# Altium schematic sheet SCH_FT232H.SchDoc
size B
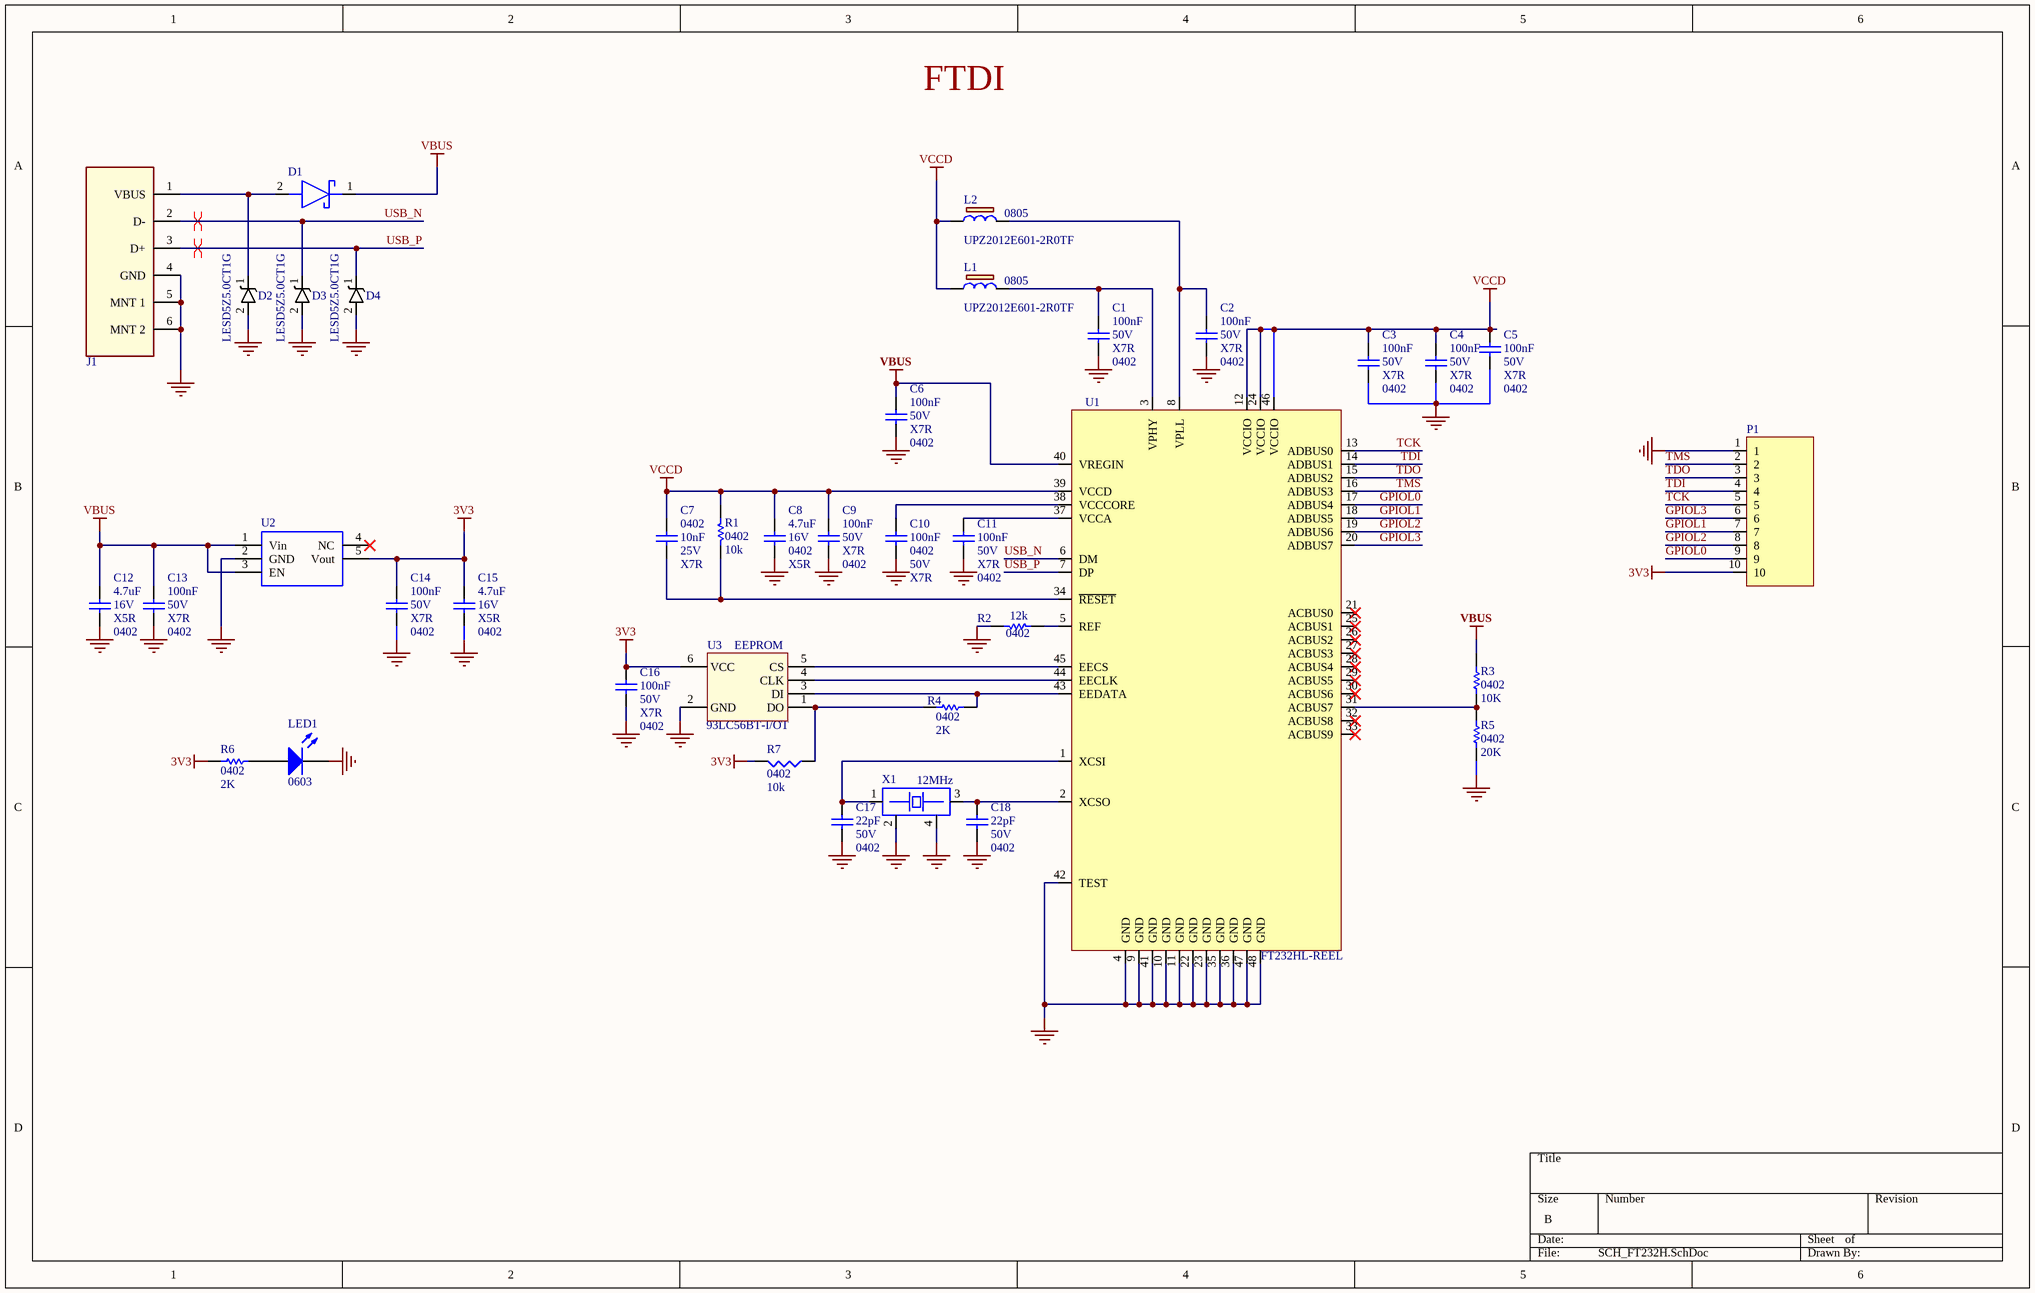
[diagram p0: SCH_FT232H.SchDoc]

## Parts
C1  value 100nF  Case/Package: 0402  Voltage: 50V  Dielectric: X7R  [CAPC0402]
C2  value 100nF  Case/Package: 0402  Voltage: 50V  Dielectric: X7R  [CAPC0402]
C3  value 100nF  Case/Package: 0402  Voltage: 50V  Dielectric: X7R  [CAPC0402]
C4  value 100nF  Case/Package: 0402  Voltage: 50V  Dielectric: X7R  [CAPC0402]
C5  value 100nF  Case/Package: 0402  Voltage: 50V  Dielectric: X7R  [CAPC0402]
C6  value 100nF  Case/Package: 0402  Voltage: 50V  Dielectric: X7R  [CAPC0402]
C7  value 10nF  Case/Package: 0402  Voltage: 25V  Dielectric: X7R  [CAPC0402]
C8  value 4.7uF  Case/Package: 0402  Voltage: 16V  Dielectric: X5R  [CAPC0402]
C9  value 100nF  Case/Package: 0402  Voltage: 50V  Dielectric: X7R  [CAPC0402]
C10  value 100nF  Case/Package: 0402  Voltage: 50V  Dielectric: X7R  [CAPC0402]
C11  value 100nF  Case/Package: 0402  Voltage: 50V  Dielectric: X7R  [CAPC0402]
C12  value 4.7uF  Case/Package: 0402  Voltage: 16V  Dielectric: X5R  [CAPC0402]
C13  value 100nF  Case/Package: 0402  Voltage: 50V  Dielectric: X7R  [CAPC0402]
C14  value 100nF  Case/Package: 0402  Voltage: 50V  Dielectric: X7R  [CAPC0402]
C15  value 4.7uF  Case/Package: 0402  Voltage: 16V  Dielectric: X5R  [CAPC0402]
C16  value 100nF  Case/Package: 0402  Voltage: 50V  Dielectric: X7R  [CAPC0402]
C17  value 22pF  Case/Package: 0402  Voltage: 50V  [CAPC0402]
C18  value 22pF  Case/Package: 0402  Voltage: 50V  [CAPC0402]
D1  (no value)  [BAT760-7]
D2  Manufacturer Part Number: LESD5Z5.0CT1G  [SOD523]
D3  Manufacturer Part Number: LESD5Z5.0CT1G  [SOD523]
D4  Manufacturer Part Number: LESD5Z5.0CT1G  [SOD523]
J1  (no value)  [Molex_48037-0001_0]
L1  Manufacturer Part Number: UPZ2012E601-2R0TF  Case/Package: 0805  [ferrite bead 600R 0.5A]
L2  Manufacturer Part Number: UPZ2012E601-2R0TF  Case/Package: 0805  [ferrite bead 600R 0.5A]
LED1  Case/Package: 0603  [led_0603]
P1  (no value)  [10 pin smd]  (no BOM)
R1  value 10k  Case/Package: 0402  [RESC0402]
R2  value 12k  Case/Package: 0402  [RESC0402]
R3  value 10K  Case/Package: 0402  [RESC0402]
R4  value 2K  Case/Package: 0402  [RESC0402]
R5  value 20K  Case/Package: 0402  [RESC0402]
R6  value 2K  Case/Package: 0402  [RESC0402]
R7  value 10k  Case/Package: 0402  [RESC0402]
U1  Manufacturer Part Number: FT232HL-REEL  [LQFP-48_7x7x05P__  FT232HL-REEL]
U2  (no value)  [SOT25]
U3  Memory Type: EEPROM  [SOT-23-6]
X1  Frequency: 12MHz  [Crystal_3225]

## Nets
3V3: C14.2 C15.2 C16.2 P1.10 R6.1 R7.2 U2.5(Vout) U3.6(VCC)
GND: C1.1 C2.1 C3.2 C4.2 C5.2 C6.1 C8.1 C9.1 C10.1 C11.1 C12.1 C13.1 C14.1 C15.1 C16.1 C17.1 C18.1 D2.2(A) D3.2(A) D4.2(A) J1.4(GND) J1.5(MNT_1) J1.6(MNT_2) LED1.K P1.1 R2.1 R5.2 U1.4(GND) U1.9(GND) U1.10(GND) U1.11(GND) U1.22(GND) U1.23(GND) U1.35(GND) U1.36(GND) U1.41(GND) U1.42(TEST) U1.47(GND) U1.48(GND) U2.2(GND) U3.2(GND) X1.2 X1.4
VBUS: C6.2 C12.2 C13.2 D1.1(K) R3.1 U1.40(VREGIN) U2.1(Vin) U2.3(EN)
VCCD: C3.1 C4.1 C5.1 C7.2 C8.2 C9.2 L1.1 L2.1 R1.2 U1.12(VCCIO) U1.24(VCCIO) U1.39(VCCD) U1.46(VCCIO)
GPIOL0: P1.9 U1.17(ADBUS4)
GPIOL1: P1.7 U1.18(ADBUS5)
GPIOL2: P1.8 U1.19(ADBUS6)
GPIOL3: P1.6 U1.20(ADBUS7)
TCK: P1.5 U1.13(ADBUS0)
TDI: P1.4 U1.14(ADBUS1)
TDO: P1.3 U1.15(ADBUS2)
TMS: P1.2 U1.16(ADBUS3)
USB_N: D3.1(K) J1.2(D-) U1.6(DM)
USB_P: D4.1(K) J1.3(D+) U1.7(DP)
NetC1_2: C1.2 L1.2 U1.3(VPHY)
NetC2_2: C2.2 L2.2 U1.8(VPLL)
NetC7_1: C7.1 R1.1 U1.34(~{RESET})
NetC10_2: C10.2 U1.38(VCCCORE)
NetC11_2: C11.2 U1.37(VCCA)
NetC17_2: C17.2 U1.1(XCSI) X1.1
NetC18_2: C18.2 U1.2(XCSO) X1.3
NetD1_2: D1.2(A) D2.1(K) J1.1(VBUS)
NetLED1_A: LED1.A R6.2
NetR2_2: R2.2 U1.5(REF)
NetR3_2: R3.2 R5.1 U1.31(ACBUS7)
NetR4_1: R4.1 R7.1 U3.1(DO)
NetR4_2: R4.2 U1.43(EEDATA) U3.3(DI)
NetU1_44: U1.44(EECLK) U3.4(CLK)
NetU1_45: U1.45(EECS) U3.5(CS)

Not connected (* = marked no-connect by the designer): U1 21(ACBUS0)* 25(ACBUS1)* 26(ACBUS2)* 27(ACBUS3)* 28(ACBUS4)* 29(ACBUS5)* 30(ACBUS6)* 32(ACBUS8)* 33(ACBUS9)*; U2 4(NC)*

## Layout directives
differential pair; net class DIFF90: USB_N, USB_P

## Notes on the sheet
- FTDI

## Library data of the parts
C1-C6 C9-C11 C13 C14 C16 = Capacitor: CAP CER 100nF 50V X7R 0402; Manufacturer Part Number: *
C7 = Capacitor: CAP CER 10nF 25V X7R 0402; Manufacturer Part Number: *
C8 C12 C15 = Capacitor: CAP CER 4.7uF 16V X5R 0402; Manufacturer Part Number: *
C17 C18 = Capacitor: CAP CER 22pF 50V 0402; Manufacturer Part Number: *
D1 = B5819WS: DIODE SCHOTTKY 40V 1A SOD323; Manufacturer Part Number: B5819WS; Case/Package: SOD-323
D2-D4 = ESD9X5.0ST5G: 12.3V Clamp 8.7A (8/20µs) Ipp Tvs Diode Surface Mount SOD-523; Case/Package: SOD-523; ComponentLink1URL: https://datasheet.ciiva.com/30478/0900766b812769b5-30478676.pdf?src-supplier=RSComponents; ComponentLink1Description: https://datasheet.ciiva.com/30478/0900766b812769b5-30478676.pdf?src-supplier=RSComponents; ComponentLink2URL: https://datasheet.ciiva.com/25958/esd9x3-3st5g-d-25958458.pdf?src-supplier=Avnet+Europe; ComponentLink2Description: https://datasheet.ciiva.com/25958/esd9x3-3st5g-d-25958458.pdf?src-supplier=Avnet+Europe; ComponentLink3URL: https://datasheet.ciiva.com/1219/1748783-1219324.pdf?src-supplier=Newark; ComponentLink3Description: https://datasheet.ciiva.com/1219/1748783-1219324.pdf?src-supplier=Newark; ComponentLink4URL: https://datasheet.ciiva.com/3304/esd9x3-3st5g-d-3304012.pdf?src-supplier=Avnet; ComponentLink4Description: https://datasheet.ciiva.com/3304/esd9x3-3st5g-d-3304012.pdf?src-supplier=Avnet; ComponentLink5URL: https://datasheet.ciiva.com/339/esd9x3-3st5g-d-339709.pdf?src-supplier=Digi-Key; ComponentLink5Description: https://datasheet.ciiva.com/339/esd9x3-3st5g-d-339709.pdf?src-supplier=Digi-Key; ComponentLink6URL: https://datasheet.ciiva.com/16215/esd9x3-3st5g-d-16215149.pdf?src-supplier=Future+Electronics; ComponentLink6Description: https://datasheet.ciiva.com/16215/esd9x3-3st5g-d-16215149.pdf?src-supplier=Future+Electronics; ComponentLink7URL: https://datasheet.ciiva.com/339/esd9x3-3st5g-d-339710.pdf?src-supplier=Digi-Key; ComponentLink7Description: https://datasheet.ciiva.com/339/esd9x3-3st5g-d-339710.pdf?src-supplier=Digi-Key; ComponentLink8URL: https://datasheet.ciiva.com/339/esd9x3-3st5g-d-339711.pdf?src-supplier=Digi-Key; ComponentLink8Description: https://datasheet.ciiva.com/339/esd9x3-3st5g-d-339711.pdf?src-supplier=Digi-Key
J1 = USB MALE: USB A-type Plug Male PCB R/A; Manufacturer Part Number: USB Type A male; Case/Package: TH
L1 L2 = Ferrite Bead: Ferrite Beads 600 OHM 25% 2A
LED1 = LED: RED LED 0603; Manufacturer Part Number: *; Value: *
P1 = Header 10: Header, 10-Pin; Manufacturer Part Number: 17-Jul-2002; Case/Package: Re-released for DXP Platform.
R1 R3 = Res1: Thick Film Resistor -  10Kohm, 1%, 0402
  R3: Manufacturer Part Number: *
R2 = Res1: Thick Film Resistor -  12Kohm, 1%, 0402; ComponentLink1URL: http://uk.rs-online.com/webdocs/0d98/0900766b80d98824.pdf?src-supplier=RSComponents; ComponentLink1Description: http://uk.rs-online.com/webdocs/0d98/0900766b80d98824.pdf?src-supplier=RSComponents; ComponentLink2URL: http://www.vishay.com/docs/20035/dcrcwe3.pdf?src-supplier=Digi-Key; ComponentLink2Description: http://www.vishay.com/docs/20035/dcrcwe3.pdf?src-supplier=Digi-Key; ComponentLink3URL: http://www.farnell.com/datasheets/2045673.pdf?src-supplier=Element14; ComponentLink3Description: http://www.farnell.com/datasheets/2045673.pdf?src-supplier=Element14; ComponentLink4URL: http://www.vishay.com/docs/20035/dcrcwe3.pdf?src-supplier=Avnet; ComponentLink4Description: http://www.vishay.com/docs/20035/dcrcwe3.pdf?src-supplier=Avnet; ComponentLink5URL: https://www.distrelec.biz/Web/Downloads/a_/en/flD-CRCW-e3_data_en.pdf?mime=application%2Fpdf&src-supplier=Distrelec; ComponentLink5Description: https://www.distrelec.biz/Web/Downloads/a_/en/flD-CRCW-e3_data_en.pdf?mime=application%2Fpdf&src-supplier=Distrelec; ComponentLink6URL: http://www.vishay.com/docs/20035/dcrcwe3.pdf?src-supplier=Mouser; ComponentLink6Description: http://www.vishay.com/docs/20035/dcrcwe3.pdf?src-supplier=Mouser; ComponentLink7URL: http://www.farnell.com/datasheets/2111203.pdf?src-supplier=Element14; ComponentLink7Description: http://www.farnell.com/datasheets/2111203.pdf?src-supplier=Element14; ComponentLink8URL: http://www.vishay.com/docs/20035/dcrcwe3.pdf?src-supplier=Future+Electronics; ComponentLink8Description: http://www.vishay.com/docs/20035/dcrcwe3.pdf?src-supplier=Future+Electronics; ComponentLink9URL: https://www.te.com/commerce/DocumentDelivery/DDEController?Action=srchrtrv&amp;DocNm=1773204-3&amp;DocType=DS&amp;DocLang=English&src-supplier=Digi-Key; ComponentLink9Description: https://www.te.com/commerce/DocumentDelivery/DDEController?Action=srchrtrv&amp;DocNm=1773204-3&amp;DocType=DS&amp;DocLang=English&src-supplier=Digi-Key; ComponentLink10URL: https://4donline.ihs.com/images/VipMasterIC/IC/TYEL/TYEL-S-A0004929575/TYEL-S-A0004929575-1.pdf?hkey=52A5661711E402568146F3353EA87419&src-supplier=Farnell; ComponentLink10Description: https://4donline.ihs.com/images/VipMasterIC/IC/TYEL/TYEL-S-A0004929575/TYEL-S-A0004929575-1.pdf?hkey=52A5661711E402568146F3353EA87419&src-supplier=Farnell; ComponentLink11URL: https://4donline.ihs.com/images/VipMasterIC/IC/TYEL/TYEL-S-A0004929575/TYEL-S-A0004929575-1.pdf?hkey=52A5661711E402568146F3353EA87419&src-supplier=Newark; ComponentLink11Description: https://4donline.ihs.com/images/VipMasterIC/IC/TYEL/TYEL-S-A0004929575/TYEL-S-A0004929575-1.pdf?hkey=52A5661711E402568146F3353EA87419&src-supplier=Newark
R4 R6 = Res1: Thick Film Resistor -  2Kohm, 1%, 0402
  R6: Manufacturer Part Number: *
R5 = Res1: Thick Film Resistor -  20Kohm, 1%, 0402; Manufacturer Part Number: *
R7 = Res: Thick Film Resistor -  10Kohm, 1%, 0402
U1 = FT232HL: USB Interface IC USB HS to UART/FIFO SPI/JTAG/I2C LQFP-48; Case/Package: LQFP-48_7x7x05P
U2 = LDO_5V_3V: LDO Voltage Regulators 600mA CMOS LDO 50mA 3.3V 250mV; Manufacturer Part Number: AP2112K-3.3TRG1; Case/Package: SOT25; ComponentLink1URL: http://www.diodes.com/datasheets/AP2112.pdf?src-supplier=Avnet; ComponentLink1Description: http://www.diodes.com/datasheets/AP2112.pdf?src-supplier=Avnet; ComponentLink2URL: https://www.diodes.com/assets/Datasheets/AP2112.pdf?src-supplier=Digi-Key; ComponentLink2Description: https://www.diodes.com/assets/Datasheets/AP2112.pdf?src-supplier=Digi-Key
U3 = 93LC56BT-I/OT: MICROCHIP - 93LC56BT-I/OT. - 2K, 128 X 16, SERIAL EE, IND ROHS COMPLIANT: YES; Density: 2Kb; Max Supply Voltage: 5.5V; Min Supply Voltage: 2.5V; Access Time: 250ns; Frequency: 2MHz; Nominal Supply Current: 2mA; Supplier 1: Digi-Key; Manufacturer: Microchip; RoHS: Yes; Category: EEPROM; Stock 1: 10933; Pricing 1: 1=0.23000, 25=0.22040, 100=0.21000 (USD); Mount: Surface Mount; Case/Package: SOT-23-6; Number of Pins: 6; Contact Plating: Tin,Matte; Min Operating Temperature: -40°C; Max Operating Temperature: 85°C; Packaging: Tape and Reel; Package Quantity: 3000; Interface: Serial; Memory Size: 2Kb; Max Frequency: 2MHz; Length: 3.1mm; Height: 1.3mm; Width: 1.8mm; Radiation Hardening: No; REACH SVHC: No SVHC; Lead Free: Lead Free; ComponentLink1URL: https://datasheet.ciiva.com/48496/jp013939-48496476.pdf?src-supplier=Avnet; ComponentLink1Description: https://datasheet.ciiva.com/48496/jp013939-48496476.pdf?src-supplier=Avnet; ComponentLink2URL: https://datasheet.ciiva.com/16216/filehandler-aspxddocname-en013939-16216574.pdf?src-supplier=Future+Electronics; ComponentLink2Description: https://datasheet.ciiva.com/16216/filehandler-aspxddocname-en013939-16216574.pdf?src-supplier=Future+Electronics; ComponentLink3URL: https://datasheet.ciiva.com/3185/jp013939-3185519.pdf?src-supplier=Avnet; ComponentLink3Description: https://datasheet.ciiva.com/3185/jp013939-3185519.pdf?src-supplier=Avnet; ComponentLink4URL: https://datasheet.ciiva.com/16622/jp013939-16622127.pdf?src-supplier=Avnet+Europe; ComponentLink4Description: https://datasheet.ciiva.com/16622/jp013939-16622127.pdf?src-supplier=Avnet+Europe; Supplier Part Number 1: 93LC56BT-I/OTCT-ND; Manufacturer Part Number: 93LC56BT-I/OT
X1 = CRYSTAL_1_1: CRYSTAL 12.0000MHZ 10PF SMD; Manufacturer Part Number: ECS-120-10-33B-CKM-TR; Case/Package: SMD-3225